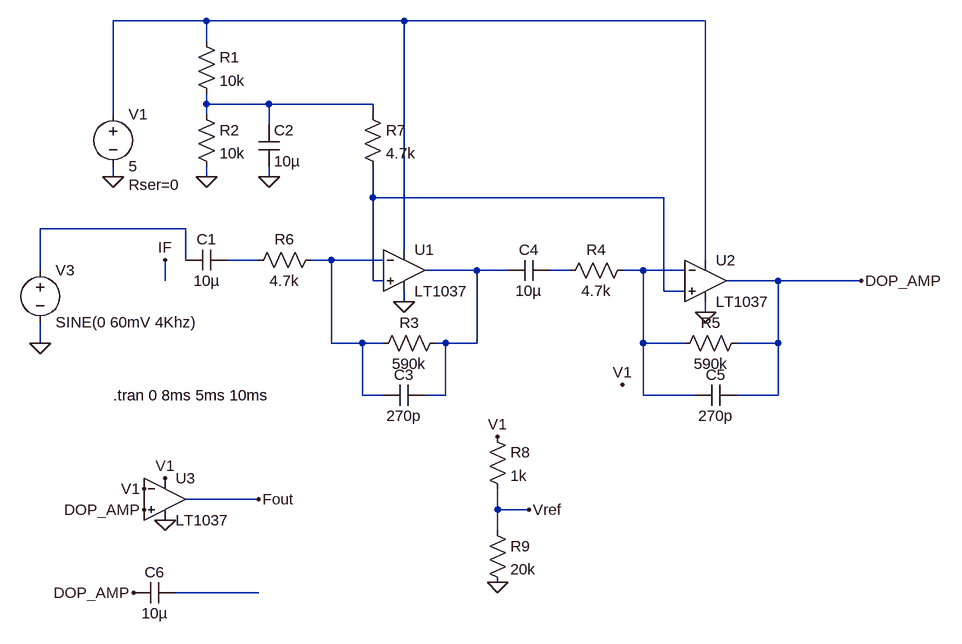
[diagram p0: schematic transiente_limpkin.asc]
transiente_limpkin.asc, the LTspice schematic file:
Version 4
SHEET 1 948 892
WIRE -192 -48 -336 -48
WIRE 112 -48 -192 -48
WIRE 576 -48 112 -48
WIRE -192 -16 -192 -48
WIRE -192 80 -192 64
WIRE -96 80 -192 80
WIRE 64 80 -96 80
WIRE -336 96 -336 -48
WIRE -192 96 -192 80
WIRE 64 96 64 80
WIRE -96 112 -96 80
WIRE -336 192 -336 176
WIRE -192 192 -192 176
WIRE -96 192 -96 176
WIRE 64 224 64 176
WIRE 512 224 64 224
WIRE -224 272 -448 272
WIRE 112 304 112 -48
WIRE -224 320 -224 272
WIRE -112 320 -160 320
WIRE 0 320 -32 320
WIRE 80 320 0 320
WIRE 576 320 576 -48
WIRE -448 336 -448 272
WIRE 224 336 144 336
WIRE 272 336 224 336
WIRE 368 336 336 336
WIRE 480 336 448 336
WIRE 544 336 480 336
WIRE -256 352 -256 320
WIRE 64 352 64 224
WIRE 80 352 64 352
WIRE 688 352 608 352
WIRE 816 352 688 352
WIRE 512 368 512 224
WIRE 544 368 512 368
WIRE 112 384 112 368
WIRE 576 400 576 384
WIRE -448 448 -448 416
WIRE 0 448 0 320
WIRE 48 448 0 448
WIRE 80 448 48 448
WIRE 176 448 160 448
WIRE 224 448 224 336
WIRE 224 448 176 448
WIRE 480 448 480 336
WIRE 544 448 480 448
WIRE 688 448 688 352
WIRE 688 448 624 448
WIRE 48 528 48 448
WIRE 80 528 48 528
WIRE 176 528 176 448
WIRE 176 528 144 528
WIRE 480 528 480 448
WIRE 560 528 480 528
WIRE 688 528 688 448
WIRE 688 528 624 528
WIRE -112 688 -224 688
WIRE 256 704 256 672
WIRE 304 704 256 704
WIRE 256 736 256 704
WIRE -112 832 -240 832
FLAG -336 192 0
FLAG -192 192 0
FLAG -96 192 0
FLAG -256 320 IF
FLAG 112 384 0
FLAG 576 400 0
FLAG 816 352 DOP_AMP
FLAG -448 448 0
FLAG -288 672 V1
FLAG -288 704 DOP_AMP
FLAG -256 720 0
FLAG 448 512 V1
FLAG -256 656 V1
FLAG -112 688 Fout
FLAG 256 816 0
FLAG 304 704 Vref
FLAG 256 592 V1
FLAG -304 832 DOP_AMP
SYMBOL voltage -336 80 R0
WINDOW 123 0 0 Left 2
WINDOW 39 24 124 Left 2
SYMATTR SpiceLine Rser=0
SYMATTR InstName V1
SYMATTR Value 5
SYMBOL cap -160 304 R90
WINDOW 0 0 32 VBottom 2
WINDOW 3 32 32 VTop 2
SYMATTR InstName C1
SYMATTR Value 10µ
SYMBOL res -208 -32 R0
SYMATTR InstName R1
SYMATTR Value 10k
SYMBOL res -208 80 R0
SYMATTR InstName R2
SYMATTR Value 10k
SYMBOL cap -112 112 R0
SYMATTR InstName C2
SYMATTR Value 10µ
SYMBOL res 176 432 R90
WINDOW 0 0 56 VBottom 2
WINDOW 3 32 56 VTop 2
SYMATTR InstName R3
SYMATTR Value 590k
SYMBOL cap 144 512 R90
WINDOW 0 0 32 VBottom 2
WINDOW 3 32 32 VTop 2
SYMATTR InstName C3
SYMATTR Value 270p
SYMBOL cap 336 320 R90
WINDOW 0 0 32 VBottom 2
WINDOW 3 32 32 VTop 2
SYMATTR InstName C4
SYMATTR Value 10µ
SYMBOL res 464 320 R90
WINDOW 0 0 56 VBottom 2
WINDOW 3 32 56 VTop 2
SYMATTR InstName R4
SYMATTR Value 4.7k
SYMBOL res 640 432 R90
WINDOW 0 0 56 VBottom 2
WINDOW 3 32 56 VTop 2
SYMATTR InstName R5
SYMATTR Value 590k
SYMBOL Opamps\\LT1037 112 272 R0
SYMATTR InstName U1
SYMBOL Opamps\\LT1037 576 288 R0
SYMATTR InstName U2
SYMBOL res -16 304 R90
WINDOW 0 0 56 VBottom 2
WINDOW 3 32 56 VTop 2
SYMATTR InstName R6
SYMATTR Value 4.7k
SYMBOL res 48 80 R0
SYMATTR InstName R7
SYMATTR Value 4.7k
SYMBOL cap 624 512 R90
WINDOW 0 0 32 VBottom 2
WINDOW 3 32 32 VTop 2
SYMATTR InstName C5
SYMATTR Value 270p
SYMBOL voltage -448 320 R0
WINDOW 123 0 0 Left 0
WINDOW 39 0 0 Left 0
SYMATTR InstName V3
SYMATTR Value SINE(0 60mV 4Khz)
SYMBOL Opamps\\LT1037 -256 624 R0
SYMATTR InstName U3
SYMBOL res 240 576 R0
SYMATTR InstName R8
SYMATTR Value 1k
SYMBOL res 240 720 R0
SYMATTR InstName R9
SYMATTR Value 20k
SYMBOL cap -240 816 R90
WINDOW 0 0 32 VBottom 2
WINDOW 3 32 32 VTop 2
SYMATTR InstName C6
SYMATTR Value 10µ
TEXT -336 528 Left 2 !.tran 0 8ms 5ms 10ms

The netlist it stands for:
* transiente_limpkin.asc
V1 N001 0 5 Rser=0
C1 N005 N004 10µ
R1 N001 N002 10k
R2 N002 0 10k
C2 N002 0 10µ
R3 N007 N006 590k
C3 N007 N006 270p
C4 N008 N007 10µ
R4 N009 N008 4.7k
R5 DOP_AMP N009 590k
XU1 N003 N006 N001 0 N007 LT1037  ; pins In+ In- V+ V- OUT
XU2 N003 N009 N001 0 DOP_AMP LT1037  ; pins In+ In- V+ V- OUT
R6 N006 N005 4.7k
R7 N002 N003 4.7k
C5 DOP_AMP N009 270p
V3 N004 0 SINE(0 60mV 4Khz)
XU3 DOP_AMP V1 V1 0 Fout LT1037  ; pins In+ In- V+ V- OUT
R8 V1 Vref 1k
R9 Vref 0 20k
C6 N010 DOP_AMP 10µ
.tran 0 8ms 5ms 10ms
.backanno
.end